# Altium schematic sheet interface.SchDoc
size A4
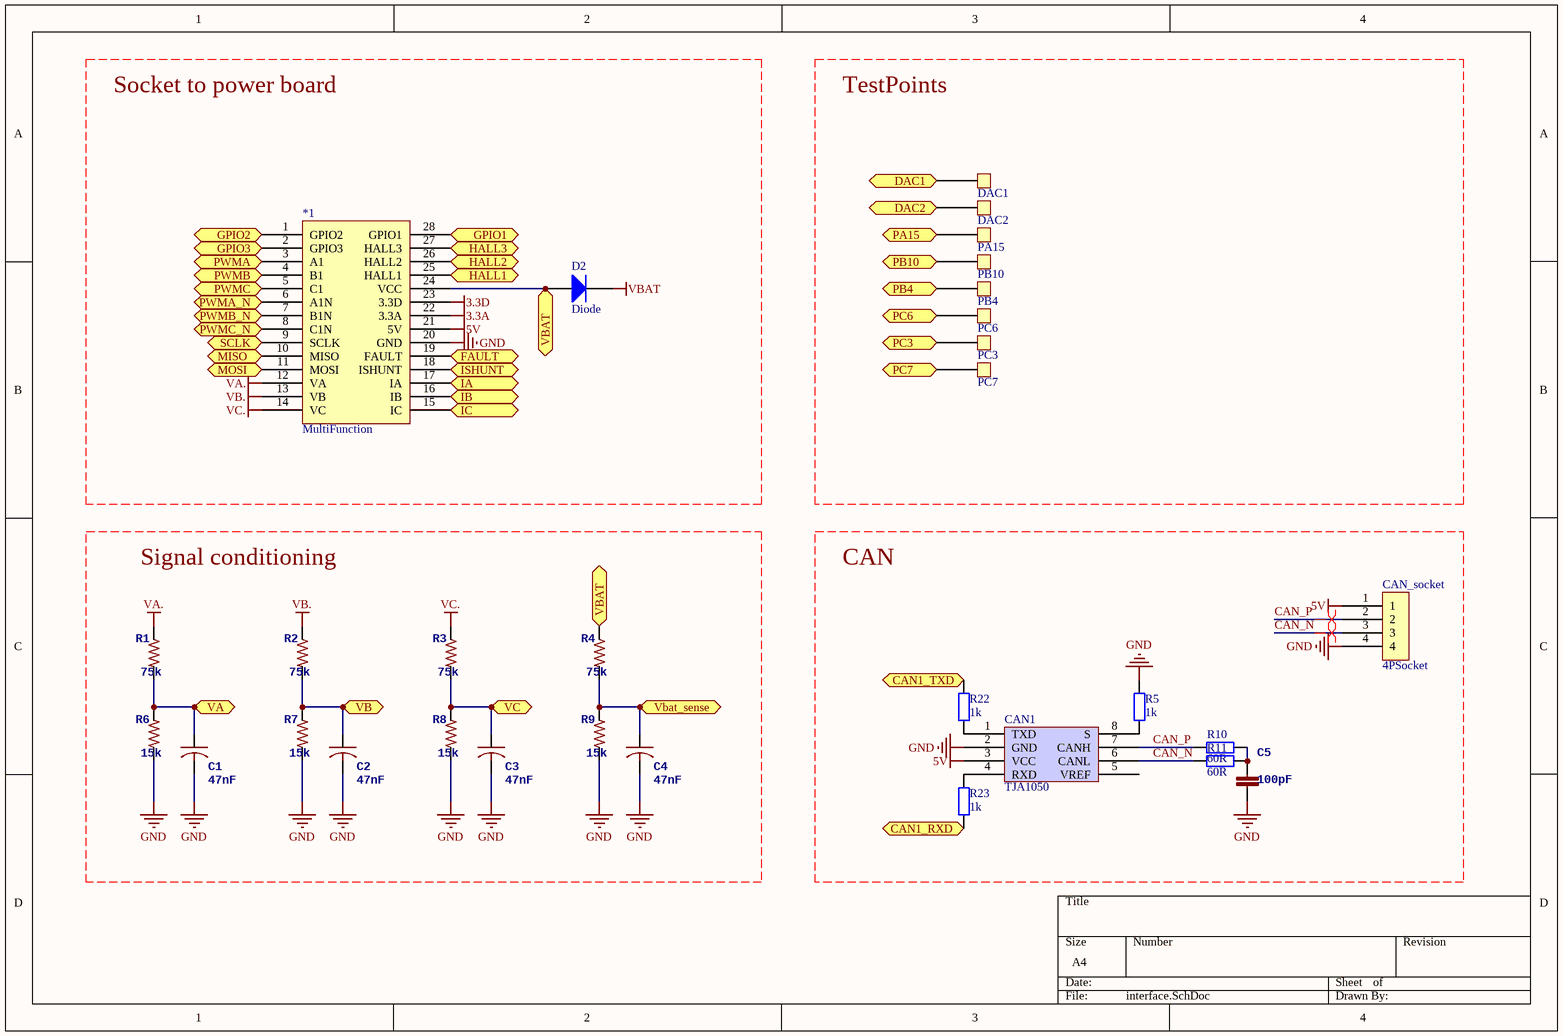
[diagram p0: interface.SchDoc]

## Parts
*1  MultiFunction  [MultiFunction]
C1  47nF  [0603]
C2  47nF  [0603]
C3  47nF  [0603]
C4  47nF  [0603]
C5  100pF  [0603]
CAN1  TJA1050  [SOIC8_39MM]
CAN_socket  4PSocket  [4pSocket]
D2  Diode  [SMA]
DAC1  TestPad  [TestPad]  (value not drawn)
DAC2  TestPad  [TestPad]  (value not drawn)
PA15  TestPad  [TestPad]  (value not drawn)
PB4  TestPad  [TestPad]  (value not drawn)
PB10  TestPad  [TestPad]  (value not drawn)
PC3  TestPad  [TestPad]  (value not drawn)
PC6  TestPad  [TestPad]  (value not drawn)
PC7  TestPad  [TestPad]  (value not drawn)
R1  75k  [0603]
R2  75k  [0603]
R3  75k  [0603]
R4  75k  [0603]
R5  1k  [0603]
R6  15k  [0603]
R7  15k  [0603]
R8  15k  [0603]
R9  15k  [0603]
R10  60R  [0603]
R11  60R  [0603]
R22  1k  [0603]
R23  1k  [0603]

## Ports
CAN1_RXD, CAN1_TXD, DAC1, DAC2, FAULT, GPIO1, GPIO2, GPIO3, HALL1, HALL2, HALL3, IA, IB, IC, ISHUNT, MISO, MOSI, PA15, PB4, PB10, PC3, PC6, PC7, PWMA, PWMA_N, PWMB, PWMB_N, PWMC, PWMC_N, SCLK, VA, VB, VBAT, Vbat_sense, VC

## Nets
3.3A: *1.22(3.3A)
3.3D: *1.23(3.3D)
5V: *1.21(5V) CAN1.3(VCC) CAN_socket.1
GND: *1.20(GND) C1.2 C2.2 C3.2 C4.2 C5.1 CAN1.2(GND) CAN_socket.4 R5.2 R6.1 R7.1 R8.1 R9.1
VA.: *1.12(VA) R1.1
VB.: *1.13(VB) R2.1
VBAT: D2.2(K)
VC.: *1.14(VC) R3.1
CAN1_RXD: R23.1 ; port CAN1_RXD
CAN1_TXD: R22.2 ; port CAN1_TXD
CAN_N: CAN1.6(CANL) CAN_socket.3 R11.2
CAN_P: CAN1.7(CANH) CAN_socket.2 R10.2
DAC1: DAC1.1 ; port DAC1
DAC2: DAC2.1 ; port DAC2
FAULT: *1.19(FAULT) ; port FAULT
GPIO1: *1.28(GPIO1) ; port GPIO1
GPIO2: *1.1(GPIO2) ; port GPIO2
GPIO3: *1.2(GPIO3) ; port GPIO3
HALL1: *1.25(HALL1) ; port HALL1
HALL2: *1.26(HALL2) ; port HALL2
HALL3: *1.27(HALL3) ; port HALL3
IA: *1.17(IA) ; port IA
IB: *1.16(IB) ; port IB
IC: *1.15(IC) ; port IC
ISHUNT: *1.18(ISHUNT) ; port ISHUNT
MISO: *1.10(MISO) ; port MISO
MOSI: *1.11(MOSI) ; port MOSI
PA15: PA15.1 ; port PA15
PB4: PB4.1 ; port PB4
PB10: PB10.1 ; port PB10
PC3: PC3.1 ; port PC3
PC6: PC6.1 ; port PC6
PC7: PC7.1 ; port PC7
PWMA: *1.3(A1) ; port PWMA
PWMA_N: *1.6(A1N) ; port PWMA_N
PWMB: *1.4(B1) ; port PWMB
PWMB_N: *1.7(B1N) ; port PWMB_N
PWMC: *1.5(C1) ; port PWMC
PWMC_N: *1.8(C1N) ; port PWMC_N
SCLK: *1.9(SCLK) ; port SCLK
VA: C1.1 R1.2 R6.2 ; port VA
VB: C2.1 R2.2 R7.2 ; port VB
VBAT: *1.24(VCC) D2.1(A) R4.1 ; port VBAT  [a separate net that carries the same name]
Vbat_sense: C4.1 R4.2 R9.2 ; port Vbat_sense
VC: C3.1 R3.2 R8.2 ; port VC
NetC5_2: C5.2 R10.1 R11.1
NetCAN1_1: CAN1.1(TXD) R22.1
NetCAN1_4: CAN1.4(RXD) R23.2
NetCAN1_8: CAN1.8(S) R5.1

Not connected (* = marked no-connect by the designer): CAN1 5(VREF)

## Layout directives
differential pair: CAN_N, CAN_P

## Notes on the sheet
- Socket to power board
- TestPoints
- Signal conditioning
- CAN

## Library data of the parts
C1-C4 = C-USC0402: 电容
C5 = CAP0402-CAP: 电容; PARTNO: CC0402ZRY5V7BB104
D2 = Diode: Default Diode; Published: 8-Jun-2000; LatestRevisionDate: 17-Jul-2002; LatestRevisionNote: Re-released for DXP Platform.; PackageVersion: Sep-1996; PackageReference: SMC; Publisher: Altium Limited; PackageDescription: DO-214-AB/SMC; 2 C-Bend Leads; Body 7.9 x 5.9 mm, inc. leads (LxW); Code_JEDEC: DO-214-AB
R1-R4 R6-R9 = RESISTOR0402-RES: 电阻
R5 R10 R11 R22 R23 = Res2: 电阻; Value: 0Ohm; Published: 8-Jun-2000; LatestRevisionDate: 17-Jul-2002; LatestRevisionNote: Re-released for DXP Platform.; PackageReference: AXIAL-0.4; Publisher: Altium Limited; PackageDescription: Axial Device, Thru-Hole; 2 Leads; 0.4 in Pin Spacing